# EAGLE design Mea_Vox_1_0a (EAGLE 7.7.0)
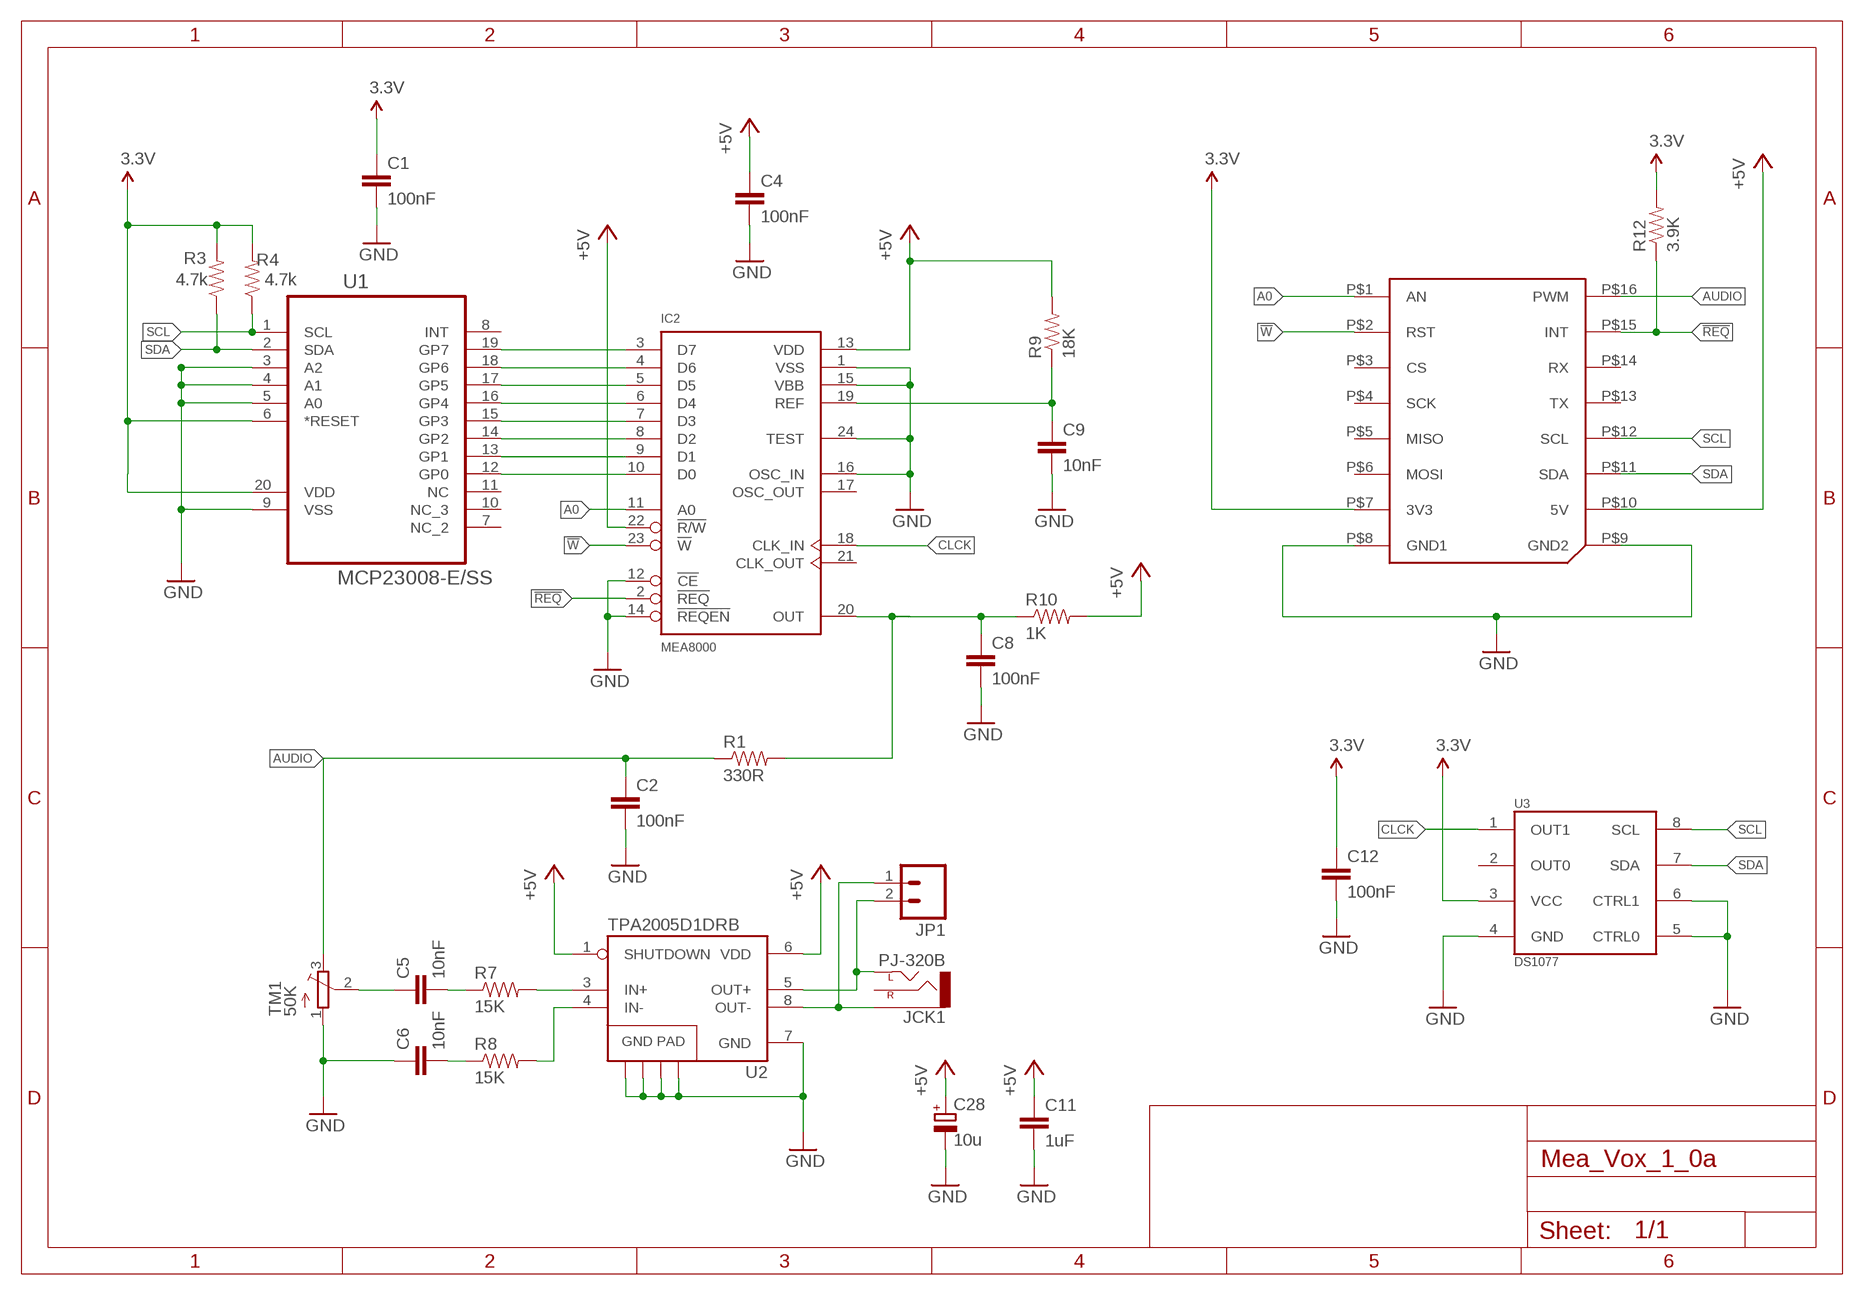
[diagram p0: schematic, sheet 1]

## Parts
C1  100nF  SPARKFUN_CAP0805  [SPARKFUN_0805]
C2  100nF  SPARKFUN_CAP0805  [SPARKFUN_0805]
C4  100nF  SPARKFUN_CAP0805  [SPARKFUN_0805]
C5  10nF  SPARKFUN_CAP0805  [SPARKFUN_0805]
C6  10nF  SPARKFUN_CAP0805  [SPARKFUN_0805]
C8  100nF  SPARKFUN_CAP0805  [SPARKFUN_0805]
C9  10nF  SPARKFUN_CAP0805  [SPARKFUN_0805]
C11  1uF  SPARKFUN_CAP0805  [SPARKFUN_0805]
C12  100nF  SPARKFUN_CAP0805  [SPARKFUN_0805]
C28  10u  CPOL-EUA/3216-18R  [A/3216-18R]
IC2  MEA8000  [DIL24-6]
JCK1  PJ-320B  [FOOTPRINT]
JP1  M02PTH  [1X02]
MK1  MIKROE_CLICKLARGE  [MIKROE_BUS_LARGE]
R1  330R  SPARKFUN_RESISTOR0805-RES  [SPARKFUN_0805]
R3  4.7k  SPARKFUN_RESISTOR0805-RES  [SPARKFUN_0805]
R4  4.7k  SPARKFUN_RESISTOR0805-RES  [SPARKFUN_0805]
R7  15K  SPARKFUN_RESISTOR0805-RES  [SPARKFUN_0805]
R8  15K  SPARKFUN_RESISTOR0805-RES  [SPARKFUN_0805]
R9  18K  SPARKFUN_RESISTOR0805-RES  [SPARKFUN_0805]
R10  1K  SPARKFUN_RESISTOR0805-RES  [SPARKFUN_0805]
R12  3.9K  SPARKFUN_RESISTOR0805-RES  [SPARKFUN_0805]
TM1  50K  TRIMPOTTC33X  [TC33X]
U1  MCP23008-E/SS  [SOP65P780X200-20N]
U2  TPA2005D1DRB  [QFN-8_PAD]
U3  DS1077  [SO08]

## Nets
3.3V: C1.1 C12.1 MK1.P$7(3V3) R3.2 R4.2 R12.2 U1.6(*RESET) U1.20(VDD) U3.3(VCC)
!REQ: IC2.2(!REQ) MK1.P$15(INT) R12.1
!W: IC2.23(!W) MK1.P$2(RST)
+5V [VDD]: C4.1 C11.1 C28.+ IC2.13(VDD) IC2.22(!R/W) MK1.P$10(5V) R9.2 R10.2 U2.1(SHUTDOWN) U2.6(VDD)
A0: IC2.11(A0) MK1.P$1(AN)
AUDIO: C2.1 MK1.P$16(PWM) R1.1 TM1.3(E)
CLCK: IC2.18(CLK_IN) U3.1(OUT1)
GND: C1.2 C2.2 C4.2 C6.1 C8.2 C9.2 C11.2 C12.2 C28.- IC2.1(VSS) IC2.12(!CE) IC2.14(!REQEN) IC2.15(VBB) IC2.16(OSC_IN) IC2.24(TEST) MK1.P$8(GND1) MK1.P$9(GND2) TM1.1(A) U1.3(A2) U1.4(A1) U1.5(A0) U1.9(VSS) U2.7(GND) U2.10(GND) U2.11(GND) U2.12(GND) U2.13(GND) U3.4(GND) U3.5(CTRL0) U3.6(CTRL1)
N$1 [0.7]: JCK1.4(SLEEVE) JP1.1 U2.8(OUT-)
N$2: IC2.10(D0) U1.12(GP0)
N$3: IC2.9(D1) U1.13(GP1)
N$4: IC2.8(D2) U1.14(GP2)
N$5: IC2.7(D3) U1.15(GP3)
N$6: IC2.6(D4) U1.16(GP4)
N$7: IC2.5(D5) U1.17(GP5)
N$8: IC2.4(D6) U1.18(GP6)
N$9: IC2.3(D7) U1.19(GP7)
N$10 [0.7]: JCK1.2(LEFT) JP1.2 U2.5(OUT+)
N$11: R7.2 U2.3(IN+)
N$12: R8.2 U2.4(IN-)
N$13: C6.2 R8.1
N$15: C5.2 R7.1
N$16: C8.1 IC2.20(OUT) R1.2 R10.1
N$17: C5.1 TM1.2(S)
N$21: C9.1 IC2.19(REF) R9.1
SCL: MK1.P$12(SCL) R4.1 U1.1(SCL) U3.8(SCL)
SDA: MK1.P$11(SDA) R3.1 U1.2(SDA) U3.7(SDA)
Unconnected: IC2.17(OSC_OUT) IC2.21(CLK_OUT) JCK1.3(RIGHT) MK1.P$3(CS) MK1.P$4(SCK) MK1.P$5(MISO) MK1.P$6(MOSI) MK1.P$13(TX) MK1.P$14(RX) U1.7(NC_2) U1.8(INT) U1.10(NC_3) U1.11(NC) U3.2(OUT0)

## Library data of the parts
C1 C2 C4-C6 C8 C9 C11 C12 = DECADE-libraries:SPARKFUN_CAP: Capacitor Standard 0603 ceramic capacitor, and 0.1" leaded capacitor.
C28 = rcl:CPOL-EU: POLARIZED CAPACITOR, European symbol; OC_MOUSER: 74-TMCMA1C106MTRF
IC2 = 8Bit_Parts:MEA8000
JCK1 = PJ320B:PJ-320B; OC_QINGPU: WQ-PJ320B
JP1 = DECADE-libraries:M02: Header 2 Standard 2-pin 0.1" header. Use with straight break away headers (SKU : PRT-00116), right angle break away headers (PRT-00553), swiss pins (PRT-00743), machine pins (PRT-00117), and female headers (PRT-00115). Molex polarized connector foot print use with SKU : PRT-08233 with associated crimp pins and housings.
MK1 = mikrobus_mea:MIKROE_CLICK
R1 R3 R4 R7-R10 R12 = DECADE-libraries:SPARKFUN_RESISTOR: Resistor Basic schematic elements and footprints for 0603, 1206, and PTH resistors.
TM1 = adafruit:TRIMPOT: SMT trimmer potentiometer part number TC33X http://www.ladyada.net/library/eagle; OC_MOUSER: 652-TC33X-2-503E
U1 = Microchip_By_element14_Batch_1:MCP23008-E/SS: IC, I/O EXPANDER, 8BIT, 1.7MHZ; MPN: MCP23008-E/SS; OC_FARNELL: 1605564; OC_MOUSER: 579-MCP23008-E/SS; OC_NEWARK: 08J8739; PACKAGE: SSOP-20; SUPPLIER: Microchip
U2 = mike-temp:TPA2005D1: 1.4W MONO CLASS-D AUDIO POWER AMPLIFIER The TPA2005D1 is a 1.4-W high efficiency filter-free class-D audio power amplifier in a BGA, QFN, or MSOP package that requires only three external components. Datasheet: http://focus.ti.com/lit/ds/symlink/tpa2005d1.pdf 1.4 W Into 8 ? From a 5V Supply at THD = 10% (Typ) Maximum Battery Life and Minimum Heat Efficiency With an 8-? Speaker: 84% at 400 mW, 79% at 100 mW 2.8-mA Quiescent Current 0.5-mA Shutdown Current Ideal for Wireless or Cellular Handsets and PDAs Capable of Driving an 8-? Speaker (2.5 V ? VDD ? 5.5 V) and a 4-? Speaker (2.5 V ? VDD ? 4.2 V) Only Three External Components Optimized PWM Output Stage Eliminates LC Output Filter Internally Generated 250-kHz Switching Frequency Eliminates Capacitor and Resistor Improved PSRR (-71 dB at 217 Hz) and Wide Supply Voltage (2.5 V to 5.5 V) Eliminates Need for a Voltage Regulator Fully Differential Design Reduces RF Rectification and Eliminates Bypass Capacitor Improved CMRR Eliminates Two Input Coupling Capacitors; OC_MOUSER: 595-TPA2005D1DRBR
U3 = SparkFun-FreqCtrl:DS1077: I2C non-volatile programmable oscillator, 16kHz to 133MHz; OC_MOUSER: 700-DS1077LZ-66

## Net classes
2 gnd: width 0.152 mm, drill 0.305 mm, clearance 0.152 mm
3 VDD: width 0.7 mm
4 0.7: width 0.7 mm

## Board
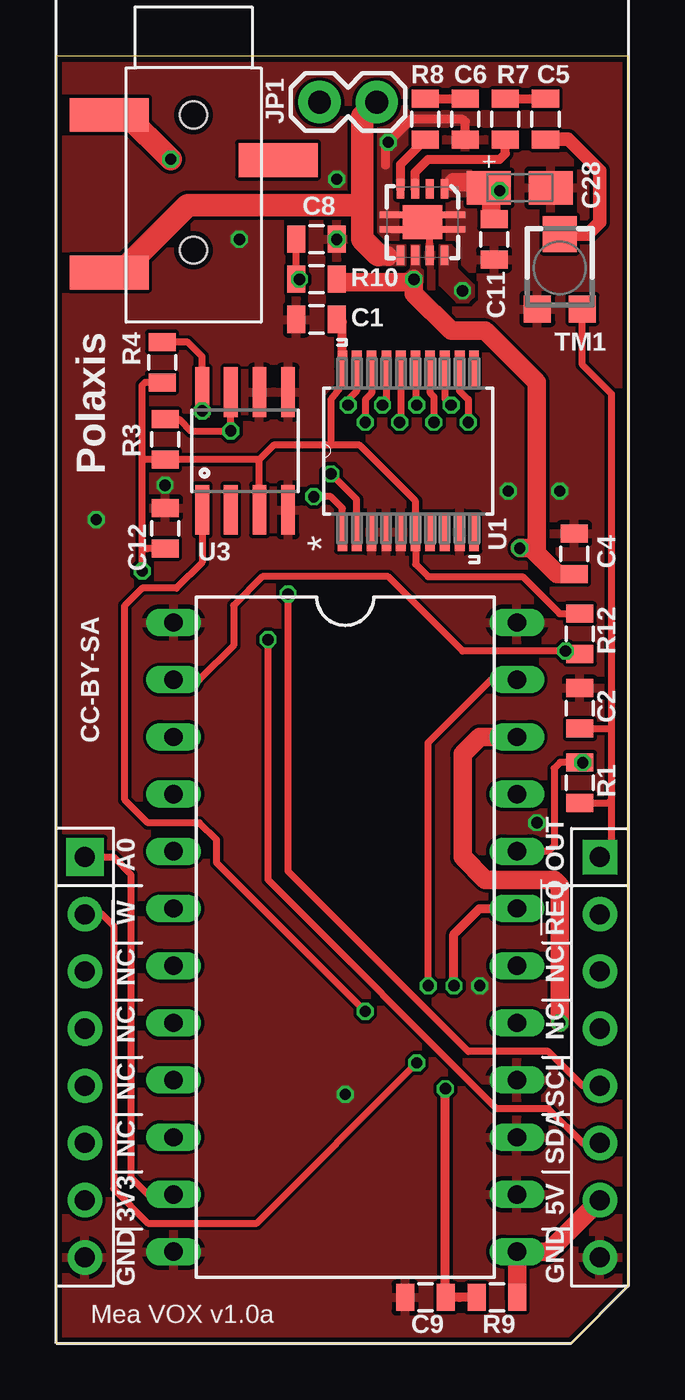
[diagram p1: board, top side]
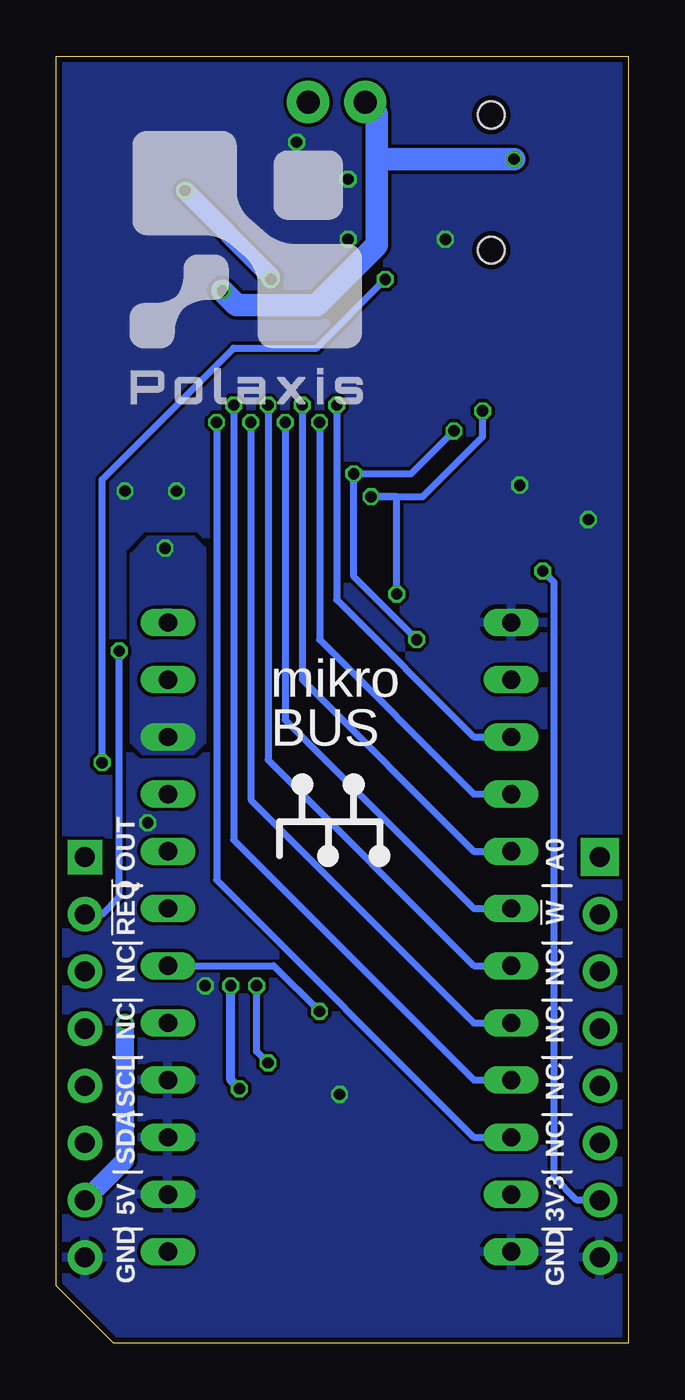
[diagram p2: board, bottom side, seen from below]

Size 25.4 x 57.15 mm. Coordinates in mm from the lower left corner, seen from the top.
Outline: 0,0 22.86,0 25.4,2.54 25.4,57.15 0,57.15 0,0
Copper layers (1*16): Top 0.018mm / dielectric 1.55mm / Bottom 0.018mm
Design rules "eC_2Layer_PClass6_BaseCopperO18_eCDefault": minimum track width 0.15mm, minimum drill 0.35mm, track to track 0.15mm, track to pad 0.15mm, pad to pad 0.15mm, via to via 0.15mm, smd to smd 0mil, copper to edge 0.25mm, drill to drill 0.35mm, minimum pad ring 0.175mm, minimum via ring 0.125mm, stop-mask expansion 0mil, vias tented up to drill 0.45mm, thermal gap 0.2mm

### Footprints (pad centres in the part's own frame; a part is rotated, then mirrored left to right if it is on the bottom)
SPARKFUN_0805 = smd 0.8 x 1.2: 1 -0.9,0; 2 0.9,0
A/3216-18R = smd 1.95 x 1.5: + 1.375,0; - -1.375,0
DIL24-6 = drill 0.813 long: 1 -13.97,-7.62; 2 -11.43,-7.62; 3 -8.89,-7.62; 4 -6.35,-7.62; 5 -3.81,-7.62; 6 -1.27,-7.62; 7 1.27,-7.62; 8 3.81,-7.62; 9 6.35,-7.62; 10 8.89,-7.62; 11 11.43,-7.62; 12 13.97,-7.62; 13 13.97,7.62; 14 11.43,7.62; 15 8.89,7.62; 16 6.35,7.62; 17 3.81,7.62; 18 1.27,7.62; 19 -1.27,7.62; 20 -3.81,7.62; 21 -6.35,7.62; 22 -8.89,7.62; 23 -11.43,7.62; 24 -13.97,7.62
FOOTPRINT = smd 1.5 x 3.5: 2 9.1,-3.75; 3 4.1,3.75; 4 2.1,-3.75 | hole 1.2: 2.1,0; 8.1,0
1X02 = drill 1.016 pad 1.88: 1 0,0; 2 2.54,0
MIKROE_BUS_LARGE = drill 0.889 pad 1.676 square: P$1 1.27,21.59 | drill 0.889 pad 1.524: P$2 1.27,19.05; P$3 1.27,16.51; P$4 1.27,13.97; P$5 1.27,11.43; P$6 1.27,8.89; P$7 1.27,6.35; P$8 1.27,3.81; P$9 24.13,3.81; P$10 24.13,6.35; P$11 24.13,8.89; P$12 24.13,11.43; P$13 24.13,13.97; P$14 24.13,16.51; P$15 24.13,19.05 | drill 0.889 pad 1.524 square: P$16 24.13,21.59
TC33X = smd 1.2 x 1.2: 1 -1,-1.825; 3 1,-1.825 | smd 1.5 x 1.6: 2 0,1.5
SOP65P780X200-20N = smd 1.676 x 0.432: 1 -3.607,2.921; 2 -3.607,2.286; 3 -3.607,1.626; 4 -3.607,0.965; 5 -3.607,0.33; 6 -3.607,-0.33; 7 -3.607,-0.965; 8 -3.607,-1.626; 9 -3.607,-2.286; 10 -3.607,-2.921; 11 3.607,-2.921; 12 3.607,-2.286; 13 3.607,-1.626; 14 3.607,-0.965; 15 3.607,-0.33; 16 3.607,0.33; 17 3.607,0.965; 18 3.607,1.626; 19 3.607,2.286; 20 3.607,2.921
QFN-8_PAD = smd 0.35 x 0.85: 1 -0.975,-1.475; 2 -0.325,-1.475; 3 0.325,-1.475; 4 0.975,-1.475; 5 0.975,1.475; 6 0.325,1.475; 7 -0.325,1.475; 8 -0.975,1.475 | smd 1.75 x 1.5: 9 0,0 | smd 1.025 x 0.28: 10 -1.387,-0.325; 11 1.387,-0.325; 12 1.387,0.325; 13 -1.387,0.325
SO08 = smd 0.61 x 2.21: 1 -1.905,-2.616; 2 -0.635,-2.616; 3 0.635,-2.616; 4 1.905,-2.616; 5 1.905,2.616; 6 0.635,2.616; 7 -0.635,2.616; 8 -1.905,2.616

### Placement (x,y rotation side)
C1  11.56,45.47 180 top
C2  23.24,28.19 90 top
C4  22.99,35.05 90 top
C5  21.72,54.36 90 top
C6  18.16,54.36 90 top
C8  11.56,49.02 0 top
C9  16.38,2.03 180 top
C11  19.43,49.02 270 top
C12  4.83,36.2 90 top
C28  20.57,51.31 180 top
IC2  12.83,18.03 270 top
JCK1  6.1,56.64 270 top
JP1  11.68,55.12 0 top
MK1  0,0 0 top
R1  23.24,24.89 90 top
R3  4.83,40.13 270 top
R4  4.7,43.56 270 top
R7  19.94,54.36 270 top
R8  16.38,54.36 270 top
R9  19.56,2.03 0 top
R10  11.56,47.24 0 top
R12  23.24,31.5 90 top
TM1  22.35,47.75 0 top
U1  15.62,39.62 90 top
U2  16.26,49.78 180 top
U3  8.38,39.62 0 top

### Tracks (layer width: path | path; a pad name or v marks a point on that pad's centre or on a via)
3.3V  (via drill 0.5)
  Top 0.305: 3.81,39.24 3.82,39.23 R3.2 9.03,39.23 9.02,39.24 | 3.81,39.24 3.81,42.55 3.94,42.67 4.69,42.67 R4.2 | C12.1 4.08,35.3 | 4.08,35.3 3.81,35.31 | 3.81,35.28 3.81,39.24 | U1.20 12.7,42.55 12.19,41.91 12.19,39.88 | 12.19,39.88 9.65,39.88 9.02,39.24 | v3.81,34.29 3.81,35.28 | 3.81,35.28 4.08,35.3 | 12.19,39.88 13.46,39.88 15.95,37.39 U1.6 15.95,34.59 16.51,34.04 20.59,34.04 20.7,34.04 22.34,32.4 R12.2 | U3.3 9.02,39.24
  Top 0.406: U1.20 12.7,45.35 C1.1
  Bottom 0.305: MK1.P$7 2.29,6.35 3.3,7.37 3.3,33.78 v3.81,34.29
!REQ  (via drill 0.5)
  Top 0.305: R12.1 22.85,30.73 v22.61,30.73 18.03,30.73 14.73,34.04 9.14,34.04 7.87,32.77 7.87,30.99 6.35,29.46 IC2.2
  Bottom 0.305: MK1.P$15 23.37,19.05 22.61,19.81 v22.61,30.73
!W  (via drill 0.5)
  Top 0.305: MK1.P$2 2.03,19.05 2.54,18.54 2.54,6.86 4.06,5.33 8.89,5.33 v16,12.45 | IC2.23 19.3,29.46 16.51,26.67 v16.51,15.88
  Bottom 0.305: v16,12.45 16.51,12.95 v16.51,15.88
+5V  (via drill 0.5)
  Top 0.813: R9.2 IC2.13 | IC2.13 21.84,4.06 MK1.P$10 | v20.57,35.31 21.08,35.31 | 21.08,35.31 21.34,35.31 21.34,42.67 19.05,44.96 17.53,44.96 15.88,46.61 v15.88,47.24 15.75,47.12 12.57,47.12 R10.2 | C4.1 22.24,34.15 21.08,35.31 | IC2.22 18.8,26.92 18.03,26.16 18.03,21.59 19.05,20.57 22.1,20.57 22.35,20.32 v22.35,14.22 | 19.18,51.44 19.18,51.33 C28.+ | 19.18,51.44 19.18,51.56 17.65,51.56 | 19.18,51.44 v19.68,51.18 19.3,50.8 19.3,49.92 C11.1
  Top 1: IC2.13
  Bottom 0.813: v19.68,51.18 15.88,47.37 v15.88,47.24 | v22.35,14.22 22.35,8.13 MK1.P$10
  pour Top (no thermals): 17.14,50.93 18.41,50.93 18.41,52.07 17.14,52.07
  pour Top (no thermals): 15.75,48.64 15.75,48.77 16.13,48.77 16.13,47.75 16.26,47.62 16.26,47.12 16.13,46.99 15.62,46.99 15.49,47.12 15.49,47.5 15.75,47.75
  pour Bottom (no thermals): 19.3,35.81 21.34,35.81 22.1,35.05 22.1,26.67 21.59,26.16 19.3,26.16 18.8,26.67 18.8,35.31
A0
  Top 0.305: MK1.P$1 2.54,21.59 3.3,20.83 3.3,7.37 4.06,6.6 IC2.11
AUDIO
  Top 0.305: 24.64,27.3 24.64,42.16 23.35,43.45 TM1.3 | 24.64,27.3 24.64,24.13 | 24.64,24.13 24.64,22.1 MK1.P$16 | R1.1 24.5,23.99 24.64,24.13 | C2.1 24.63,27.29 24.64,27.3
CLCK  (via drill 0.5)
  Top 0.305: v13.72,14.73 7.11,21.34 7.11,22.35 6.35,23.11 4.06,23.11 3.05,24.13 3.05,32.77 3.81,33.53 5.33,33.53 6.48,34.67 U3.1
  Bottom 0.305: IC2.18 15.75,16.76 v13.72,14.73
GND  (via drill 0.5)
  Top 0.305: U2.7 16.58,49.35 | U2.13 16.69,49.46 16.58,49.35 | U2.12 16.47,49.46 16.58,49.35
  Top 0.406: C6.1 18.16,54.23 18.03,54.36 15.75,54.36 v14.73,53.34 14.61,53.21 14.61,52.32
  other vias: 8.13,49.02 1.78,36.58 4.83,38.1 12.83,11.05 12.45,49.02 12.45,51.69 18.8,15.88 20.07,37.85 21.34,23.11 22.35,37.85
  pour Top (rank 2): 0,0 25.4,0 25.4,63.25 0,63.25
  pour Bottom (rank 2): 0,0 25.4,0 25.4,60.96 0,60.96
N$1  (via drill 0.5)
  Top 1: v5.08,52.58 3.05,54.61 JCK1.4
  Bottom 1: v18.03,46.74 17.4,46.1 13.84,46.1 11.18,48.77 11.18,52.45 | v5.08,52.58 11.05,52.58 arc-90 11.18,52.45 | JP1.1 11.18,54.61 11.18,52.45
  pour Top (no thermals): 17.02,48.77 17.02,46.99 17.78,46.23 18.29,46.23 18.54,46.48 18.54,46.99 17.78,47.75 17.78,48.51 17.53,48.77
N$2  (via drill 0.5)
  Top 0.305: U1.12 17.91,42.29 18.29,41.91 v18.29,40.89
  Bottom 0.305: v18.29,40.89 18.29,20.57 6.86,9.14 IC2.10
N$3  (via drill 0.5)
  Top 0.305: U1.13 17.25,41.94 v17.53,41.66
  Bottom 0.305: v17.53,41.66 17.53,22.35 6.86,11.68 IC2.9
N$4  (via drill 0.5)
  Top 0.305: U1.14 16.59,42.22 16.76,42.04 v16.76,40.89
  Bottom 0.305: v16.76,40.89 16.76,24.13 6.86,14.22 IC2.8
N$5  (via drill 0.5)
  Top 0.305: U1.15 15.95,41.71 v16,41.66
  Bottom 0.305: v16,41.66 16,25.91 6.86,16.76 IC2.7
N$6  (via drill 0.5)
  Top 0.305: U1.16 15.29,40.95 v15.24,40.89
  Bottom 0.305: v15.24,40.89 15.24,27.69 6.86,19.3 IC2.6
N$7  (via drill 0.5)
  Top 0.305: U1.17 14.66,41.83 v14.48,41.66
  Bottom 0.305: v14.48,41.66 14.48,29.46 6.86,21.84 IC2.5
N$8  (via drill 0.5)
  Top 0.305: U1.18 13.99,42.19 13.72,41.91 v13.72,40.89
  Bottom 0.305: v13.72,40.89 13.72,31.24 6.86,24.38 IC2.4
N$9  (via drill 0.5)
  Top 0.305: U1.19 13.34,42.29 12.95,41.91 v12.95,41.66
  Bottom 0.305: v12.95,41.66 12.95,33.02 6.86,26.92 IC2.3
N$10
  Top 0.813: 14.3,48.31 14.68,48.31 14.73,48.26
  Top 1: 14.3,48.31 13.59,49.02 13.59,50.55 | 13.59,50.55 5.84,50.55 3.05,47.75 2.29,47.6 JCK1.2 | 13.59,50.55 13.59,54.48 JP1.2
  pour Top (no thermals): 14.35,47.88 15.49,47.88 15.49,48.77 14.35,48.77
N$11
  Top 0.406: U2.3 15.93,52 16.51,52.58 19.68,52.58 19.94,52.83 R7.2
N$12
  Top 0.406: U2.4 15.28,52.35 R8.2
N$13
  Top 0.406: R8.1 C6.2
N$15
  Top 0.406: R7.1 C5.2
N$16  (via drill 0.5)
  Top 0.305: C8.1 R10.1 v10.79,47.24 | IC2.20 21.84,21.84 22.1,22.1 22.1,25.53 22.36,25.79 R1.2 23.36,25.79 v23.37,25.78
  Bottom 0.305: v23.37,25.78 23.37,38.35 17.53,44.2 13.84,44.2 v10.79,47.24
N$17
  Top 0.406: C5.1 21.71,53.46
  Top 0.61: TM1.2 23.6,49.25 24.13,49.78 24.13,52.07 22.73,53.47 C5.1
N$21  (via drill 0.5)
  Top 0.305: C9.1 17.91,2.03
  Top 0.406: R9.1 17.91,2.03 C9.1 v17.27,11.3 | v17.65,15.88 17.65,18.16 18.8,19.3 IC2.19
  Bottom 0.406: v17.27,11.3 17.65,11.68 v17.65,15.88
SCL  (via drill 0.5)
  Top 0.305: R4.1 5.84,44.45 6.48,43.81 U3.8 v6.48,41.4 | MK1.P$12 23.37,11.43 21.84,12.95 18.29,12.95 10.29,20.95 v10.29,33.27 | U1.1 12.7,37.08 12.19,37.59 v11.43,37.59
  Bottom 0.305: v6.48,41.4 6.48,40.26 9.14,37.59 v11.43,37.59 10.29,37.59 v10.29,33.27
SDA  (via drill 0.5)
  Top 0.305: R3.1 5.45,41.03 5.97,40.51 v7.75,40.51 | v7.75,40.51 U3.7 | MK1.P$11 23.37,8.89 21.84,10.41 19.56,10.41 9.4,20.57 v9.4,31.24 | U1.2 13.34,37.47 v12.19,38.61 | v7.75,40.51 7.81,40.45
  Bottom 0.305: v7.75,40.51 9.65,38.61 v12.19,38.61 12.19,34.04 v9.4,31.24

### Text on the board
tNames: + | Polaxis | CC-BY-SA | Mea VOX v1.0a